# Altium schematic sheet UpDuino Camera Adaptor_V2.0.SchDoc
size B; SheetNumber: 1; SheetTotal: 1
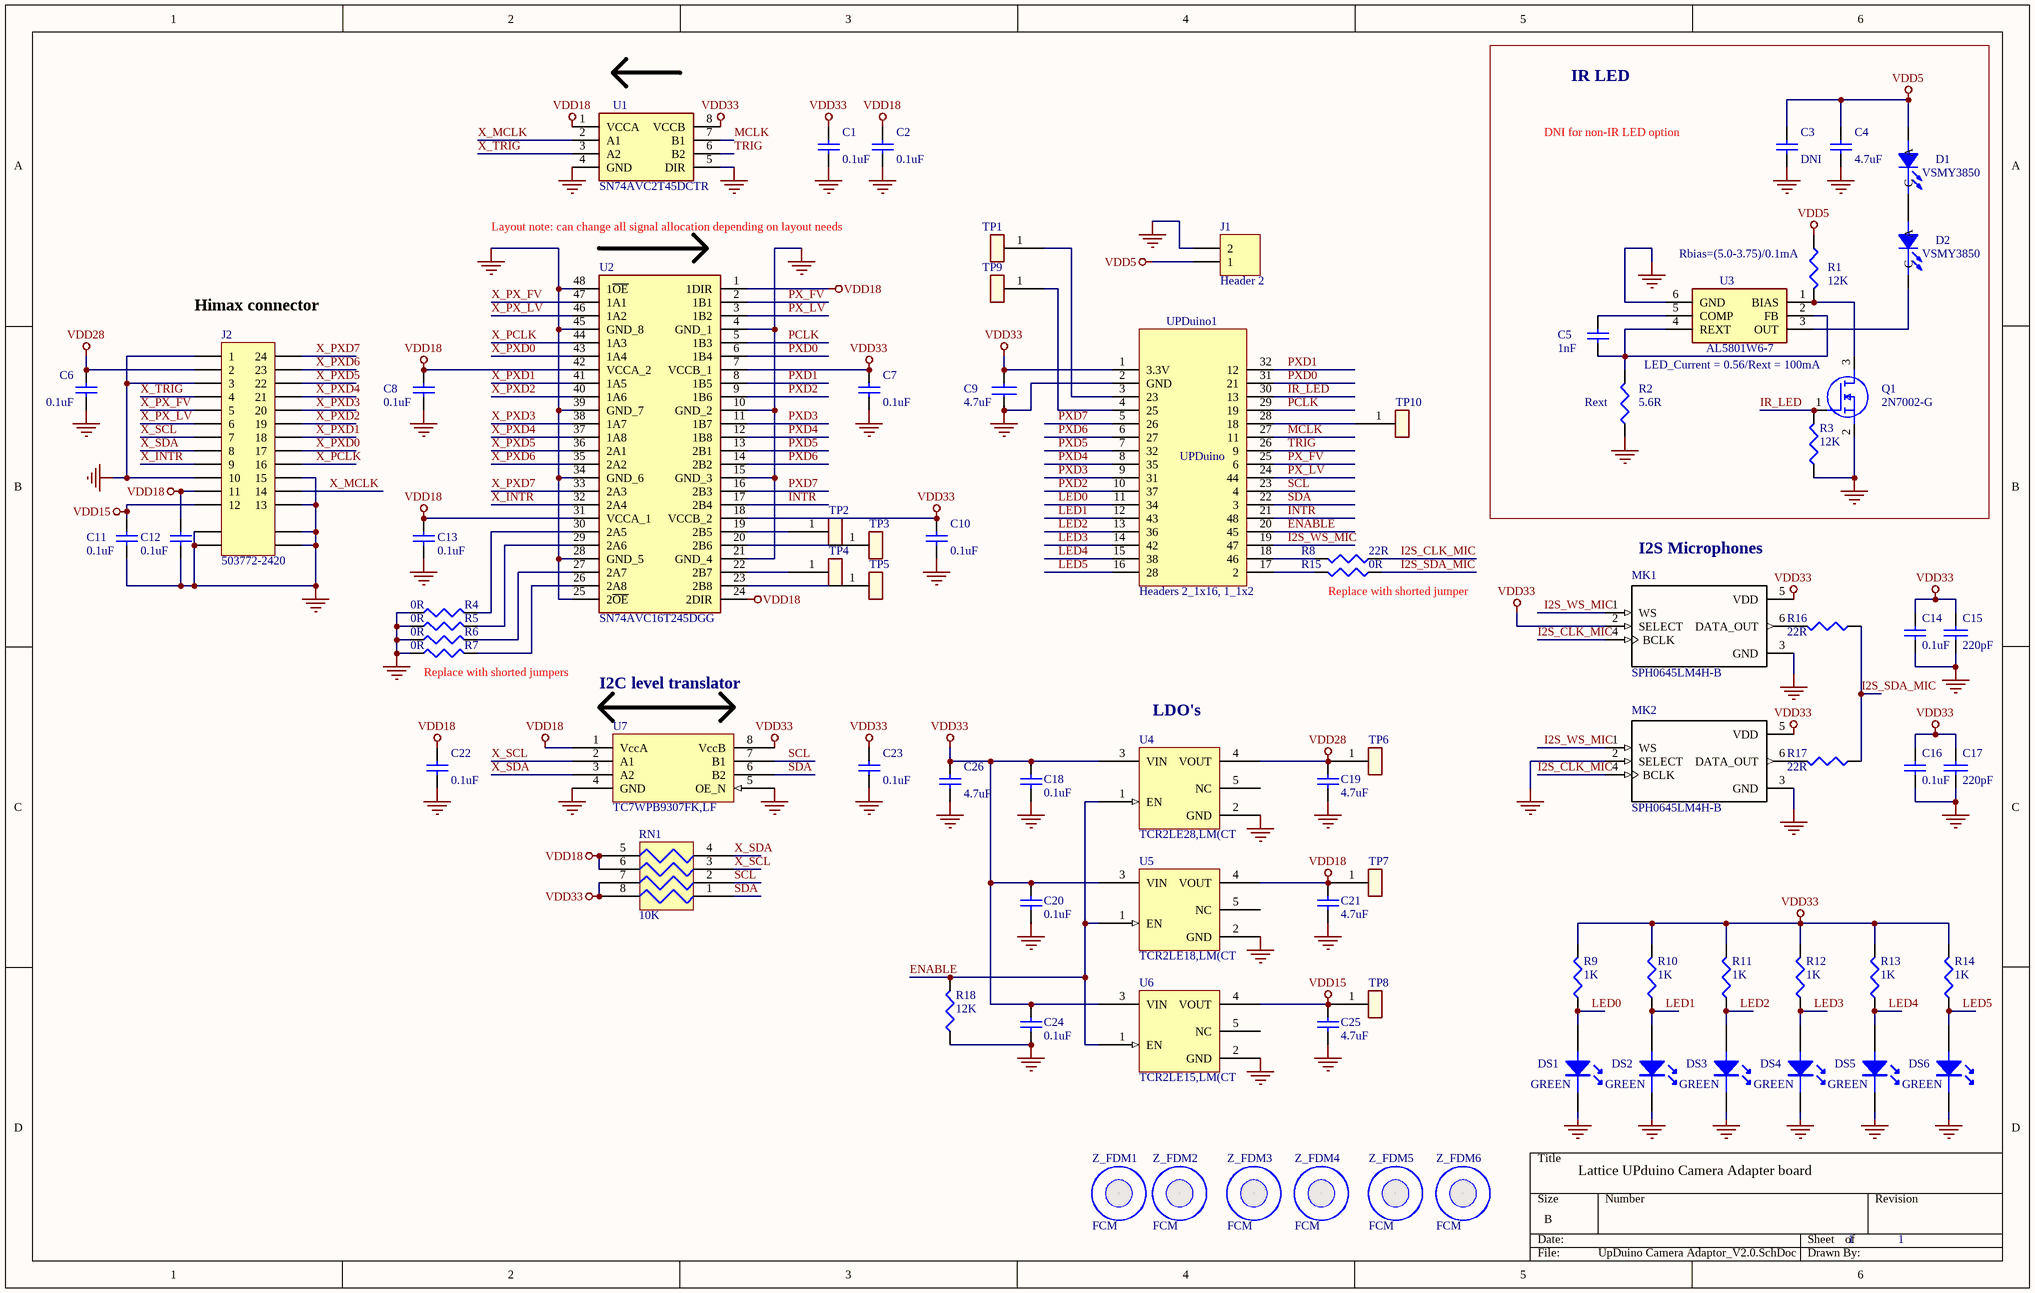
[diagram p0: UpDuino Camera Adaptor_V2.0.SchDoc]

## Parts
C1  0.1uF  [C0603]
C2  0.1uF  [C0603]
C3  DNI  [C0603]
C4  4.7uF  [C0603]
C5  1nF  [C0603]
C6  0.1uF  [C0603]
C7  0.1uF  [C0603]
C8  0.1uF  [C0603]
C9  4.7uF  [C0603]
C10  0.1uF  [C0603]
C11  0.1uF  [C0603]
C12  0.1uF  [C0603]
C13  0.1uF  [C0603]
C14  0.1uF  [C0603]
C15  220pF  [C0603]
C16  0.1uF  [C0603]
C17  220pF  [C0603]
C18  0.1uF  [C0603]
C19  4.7uF  [C0603]
C20  0.1uF  [C0603]
C21  4.7uF  [C0603]
C22  0.1uF  [C0603]
C23  0.1uF  [C0603]
C24  0.1uF  [C0603]
C25  4.7uF  [C0603]
C26  4.7uF  [C0603]
D1  VSMY3850  [PLCC-2]
D2  VSMY3850  [PLCC-2]
DS1  GREEN  [LED_0603_12]
DS2  GREEN  [LED_0603_12]
DS3  GREEN  [LED_0603_12]
DS4  GREEN  [LED_0603_12]
DS5  GREEN  [LED_0603_12]
DS6  GREEN  [LED_0603_12]
J1  Header 2  [HDR1X2]
J2  503772-2420  [MOLEX-5037722410_MOLEX]
MK1  SPH0645LM4H-B  [*MIC_SPH0645LM4H-B]
MK2  SPH0645LM4H-B  [*MIC_SPH0645LM4H-B]
Q1  2N7002-G  [SOT23-3]
R1  12K  [R0603]
R2  5.6R  [R0603]
R3  12K  [R0603]
R4  0R  [SB_0603]
R5  0R  [SB_0603]
R6  0R  [SB_0603]
R7  0R  [SB_0603]
R8  22R  [R0603]
R9  1K  [R0603]
R10  1K  [R0603]
R11  1K  [R0603]
R12  1K  [R0603]
R13  1K  [R0603]
R14  1K  [R0603]
R15  0R  [SB_0603]
R16  22R  [R0603]
R17  22R  [R0603]
R18  12K  [R0603]
RN1  10K  [RN4(0402)]
TP1  TEST POINT  [TP_SMD_D1]  (value not drawn)
TP2  TEST POINT  [TP_SMD_D1]  (value not drawn)
TP3  TEST POINT  [TP_SMD_D1]  (value not drawn)
TP4  TEST POINT  [TP_SMD_D1]  (value not drawn)
TP5  TEST POINT  [TP_SMD_D1]  (value not drawn)
TP6  TEST POINT  [TP_SMD_D1]  (value not drawn)
TP7  TEST POINT  [TP_SMD_D1]  (value not drawn)
TP8  TEST POINT  [TP_SMD_D1]  (value not drawn)
TP9  TEST POINT  [TP_SMD_D1]  (value not drawn)
TP10  TEST POINT  [TP_SMD_D1]  (value not drawn)
U1  SN74AVC2T45DCTR  [MSOP-8(2.95x2.80)]
U2  SN74AVC16T245DGG  [TSSOP-48]
U3  AL5801W6-7  [SOT-23-6-(SSOT-6)]
U4  TCR2LE28,LM(CT  [SOT-553]
U5  TCR2LE18,LM(CT  [SOT-553]
U6  TCR2LE15,LM(CT  [SOT-553]
U7  TC7WPB9307FK,LF  [SSOP8-P-0.50A]
UPDuino1  Headers 2_1x16, 1_1x2  [UPDuino-SMD]
Z_FDM1  FCM  [FID100X250N]
Z_FDM2  FCM  [FID100X250N]
Z_FDM3  FCM  [FID100X250N]
Z_FDM4  FCM  [FID100X250N]
Z_FDM5  FCM  [FID100X250N]
Z_FDM6  FCM  [FID100X250N]

## Blocks framed on the sheet
IR LED: C3-C5 D1 D2 Q1 R1-R3 U3

## Nets
GND: C1.2 C2.2 C3.2 C4.2 C6.2 C7.2 C8.2 C9.1 C10.2 C11.2 C12.2 C13.2 C14.2 C15.2 C16.2 C17.2 C18.1 C19.1 C20.1 C21.1 C22.2 C23.2 C24.1 C25.1 C26.2 DS1.2 DS2.2 DS3.2 DS4.2 DS5.2 DS6.2 J1.2 J2.1 J2.3 J2.10 J2.13 J2.15 J2.GND1 J2.GND2 J2.GND3 J2.GND4 MK1.3(GND) MK2.2(SELECT) MK2.3(GND) Q1.2(S) R2.2 R3.1 R4.2 R5.2 R6.2 R7.2 R18.1 U1.4(GND) U1.5(DIR) U2.4(GND_1) U2.10(GND_2) U2.15(GND_3) U2.21(GND_4) U2.25(2~{OE}) U2.28(GND_5) U2.34(GND_6) U2.39(GND_7) U2.45(GND_8) U2.48(1~{OE}) U3.6(GND) U4.2(GND) U5.2(GND) U6.2(GND) U7.4(GND) U7.5(OE_N) UPDuino1.2(GND)
VDD5: C3.1 C4.1 D1.A J1.1 R1.2
VDD15: C11.1 C25.2 J2.12 TP8.1 U6.4(VOUT)
VDD18: C2.1 C8.1 C12.1 C13.1 C21.2 C22.1 J2.11 RN1.5 RN1.6 TP7.1 U1.1(VCCA) U2.1(1DIR) U2.24(2DIR) U2.31(VCCA_1) U2.42(VCCA_2) U5.4(VOUT) U7.1(VccA)
VDD28: C6.1 C19.2 J2.2 TP6.1 U4.4(VOUT)
VDD33: C1.1 C7.1 C9.2 C10.1 C14.1 C15.1 C16.1 C17.1 C18.2 C20.2 C23.1 C24.2 C26.1 MK1.2(SELECT) MK1.5(VDD) MK2.5(VDD) R9.2 R10.2 R11.2 R12.2 R13.2 R14.2 RN1.7 RN1.8 U1.8(VCCB) U2.7(VCCB_1) U2.18(VCCB_2) U4.3(VIN) U5.3(VIN) U6.3(VIN) U7.8(VccB) UPDuino1.1(3.3V)
ENABLE: R18.2 U4.1(EN) U5.1(EN) U6.1(EN) UPDuino1.20(45)
I2S_CLK_MIC: MK1.4(BCLK) MK2.4(BCLK) R8.1
I2S_SDA_MIC: R15.1 R16.1 R17.1
I2S_WS_MIC: MK1.1(WS) MK2.1(WS) UPDuino1.19(47)
INTR: U2.17(2B4) UPDuino1.21(48)
IR_LED: Q1.1(G) R3.2 UPDuino1.30(13)
LED0: DS1.1 R9.1 UPDuino1.11(34)
LED1: DS2.1 R10.1 UPDuino1.12(43)
LED2: DS3.1 R11.1 UPDuino1.13(36)
LED3: DS4.1 R12.1 UPDuino1.14(42)
LED4: DS5.1 R13.1 UPDuino1.15(38)
LED5: DS6.1 R14.1 UPDuino1.16(28)
MCLK: U1.7(B1) UPDuino1.27(11)
PCLK: U2.5(1B3) UPDuino1.29(19)
PX_FV: U2.2(1B1) UPDuino1.25(6)
PX_LV: U2.3(1B2) UPDuino1.24(44)
PXD0: U2.6(1B4) UPDuino1.31(21)
PXD1: U2.8(1B5) UPDuino1.32(12)
PXD2: U2.9(1B6) UPDuino1.10(37)
PXD3: U2.11(1B7) UPDuino1.9(31)
PXD4: U2.12(1B8) UPDuino1.8(35)
PXD5: U2.13(2B1) UPDuino1.7(32)
PXD6: U2.14(2B2) UPDuino1.6(27)
PXD7: U2.16(2B3) UPDuino1.5(26)
SCL: RN1.2 U7.7(B1) UPDuino1.23(4)
SDA: RN1.1 U7.6(B2) UPDuino1.22(3)
TRIG: U1.6(B2) UPDuino1.26(9)
X_INTR: J2.9 U2.32(2A4)
X_MCLK: J2.14 U1.2(A1)
X_PCLK: J2.16 U2.44(1A3)
X_PX_FV: J2.5 U2.47(1A1)
X_PX_LV: J2.6 U2.46(1A2)
X_PXD0: J2.17 U2.43(1A4)
X_PXD1: J2.18 U2.41(1A5)
X_PXD2: J2.19 U2.40(1A6)
X_PXD3: J2.20 U2.38(1A7)
X_PXD4: J2.21 U2.37(1A8)
X_PXD5: J2.22 U2.36(2A1)
X_PXD6: J2.23 U2.35(2A2)
X_PXD7: J2.24 U2.33(2A3)
X_SCL: J2.7 RN1.3 U7.2(A1)
X_SDA: J2.8 RN1.4 U7.3(A2)
X_TRIG: J2.4 U1.3(A2)
NetC5_1: C5.1 U3.5(COMP)
NetC5_2: C5.2 R2.1 U3.2(FB) U3.4(REXT)
NetD1_C: D1.C D2.A
NetD2_C: D2.C U3.3(OUT)
NetMK1_6: MK1.6(DATA_OUT) R16.2
NetMK2_6: MK2.6(DATA_OUT) R17.2
NetQ1_3: Q1.3(D) R1.1 U3.1(BIAS)
NetR4_1: R4.1 U2.30(2A5)
NetR5_1: R5.1 U2.29(2A6)
NetR6_1: R6.1 U2.27(2A7)
NetR7_1: R7.1 U2.26(2A8)
NetR8_2: R8.2 UPDuino1.18(46)
NetR15_2: R15.2 UPDuino1.17(2)
NetTP1_1: TP1.1 UPDuino1.3(23)
NetTP2_1: TP2.1 U2.19(2B5)
NetTP3_1: TP3.1 U2.20(2B6)
NetTP4_1: TP4.1 U2.22(2B7)
NetTP5_1: TP5.1 U2.23(2B8)
NetTP9_1: TP9.1 UPDuino1.4(25)
NetTP10_1: TP10.1 UPDuino1.28(18)

Not connected (* = marked no-connect by the designer): U4 5(NC); U5 5(NC); U6 5(NC); Z_FDM1 1; Z_FDM2 1; Z_FDM3 1; Z_FDM4 1; Z_FDM5 1; Z_FDM6 1

## Notes on the sheet
- DNI for non-IR LED option
- Layout note: can change all signal allocation depending on layout needs
- (near R1) Rbias=(5.0-3.75)/0.1mA
- (near J2) Himax connector
- (near Q1) LED_Current = 0.56/Rext = 100mA
- (near R2) Rext
- (near MK1) I2S Microphones
- (near R15) Replace with shorted jumper
- (near R7) Replace with shorted jumpers
- I2C level translator
- (near U4) LDO's
- Lattice UPduino Camera Adapter board
- 1
- (in symbol UPDuino_Breakout) UPDuino

## Library data of the parts
C1 C2 C6 C7 C10-C12 C14 C16 C22 C23 = Cap_100nF_X7R_10%_0402: CAP CER 0.1UF 6.3V X5R 0603
C3 = Cap_100nF_X7R_10%_0402
C4 C26 = Cap_100nF_X7R_10%_0402: CAP CER 4.7UF 6.3V X5R 0603
C5 = Cap_100nF_X7R_10%_0402: CAP CER 0.1UF 6.3V X5R 0402; Manufacturer: TDK; Part #: E-CAP-003; ManType: C1005X5R0J104K; Digikey: 445-1266-1-ND; Package: 0402
C8 C13 = Cap_100nF_X7R_10%_0402: CAP CER 0.1UF 6.3V X5R 0402
C9 = CAP NP: 4.7 uF 6.3V X5R
C15 C17 = CAP
C18 C20 C24 = Cap_1uF_X5R_10%_6V3_0402: CAP CER 0.1UF 6.3V X5R 0603
C19 C21 C25 = Cap_1uF_X5R_10%_6V3_0402: CAP CER 4.7UF 6.3V X5R 0603
D1 D2 = LED: EMITTER IR 850NM 70MA 3.20MM SMD; Manufacturer: OSRAM Opto Semiconductors Inc.; Manufacturer Part Number: VSMY12850; ManType: SFH 4253-Z; Viewing Angle: 80°; Forward Current: 20mA; Forward Voltage: 1.4V; Rise Time: 10ns; Touchscreen: Infrared (IR); DigiKey: 475-2868-1-ND; Part #: *; Supplier 1: Avnet; Stock 1: 0; Pricing 1: 1=0.404 (USD); Mount: Surface Mount; Case/Package: 1206; Case Code (Metric): 3216; Case Code (Imperial): 1206; Min Operating Temperature: -40°C; Max Operating Temperature: 85°C; Packaging: Cut Tape; Wavelength: 850nm; Orientation: Top View; REACH SVHC: Unknown; Lead Free: Lead Free
DS1-DS6 = LED_1: Liteon LTST-C191KGKT; Manufacturer: Avago Technologies US Inc.; Part #: E-MISC-005; ManType: HSMG-C170; Digikey: 516-1434-1-ND; Price 100: 0.21200; Package: 0805
J1 = Header 2: Header, 2-Pin; LatestRevisionDate: 17-Jul-2002; LatestRevisionNote: Re-released for DXP Platform.; Publisher: Altium Limited
J2 = Header 12X2A: Header, 12-Pin, Dual row; Manufacturer: Amphenol FCI; Manufacturer Part Number: SFV24R-3STE1HLF; Actuator Material: Glass,Polyphenylene; Voltage Rating: 50V; Current Rating: 500mA; Number of Positions: 24; Contact Location: Bottom; Insulation Resistance: 100MR; Pitch: 0.02inch; LatestRevisionDate: 17-Jul-2002; LatestRevisionNote: Re-released for DXP Platform.; Publisher: Altium Limited; Supplier 1: Mouser; Supplier Part Number 1: 649-SFV24R-3STE1HLF; Stock 1: 6000; Pricing 1: 1=0.41, 10=0.288, 50=0.288, 100=0.276, 1000=0.198, 10000=0.158 (USD); Mount: Surface Mount; Contact Material: Bronze; Contact Plating: Tin; Housing Material: Polymer; Min Operating Temperature: -55°C; Max Operating Temperature: 105°C; Package Quantity: 3000; Packaging: Tape and Reel; Termination: Solder; Flammability Rating: UL94 V-0; ComponentLink1URL: http://portal.fciconnect.com/Comergent//fci/drawing/10117319.pdf?src-supplier=Digi-Key; ComponentLink1Description: http://portal.fciconnect.com/Comergent//fci/drawing/10117319.pdf?src-supplier=Digi-Key
MK1 MK2 = SPH0645LM4H-B: Mic Mems Digital I2s Omni -26db; MFR: Knowles; Package: SIP-7 Bourns; MFR Part No.: SPH0645LM4H-B; Digi-Key_Purchase_URL: https://www.digikey.com/product-detail/en/knowles/SPH0645LM4H-B/423-1405-1-ND/5332432?utm_source=snapeda&utm_medium=aggregator&utm_campaign=symbol; Digi-Key_Part_Number: 423-1405-1-ND; SnapEDA_Link: https://www.snapeda.com/parts/SPH0645LM4H-B/Knowles/view-part/?ref=snap; Value: *
Q1 = 2N7002-G: MOSFET (N-Channel); Manufacturer_Name: Comchip Technology; Datasheet Link: http://www.comchiptech.com/admin/files/product/2N7002-G%20RevB201450.pdf; Height: 1.25mm; Manufacturer_Part_Number: 2N7002-G; Mouser Part Number: 750-2N7002-G; Mouser Price/Stock: https://www.mouser.com/Search/Refine.aspx?Keyword=750-2N7002-G
R1-R18 = R_SH
RN1 = EXB28V: EXB-28V104JX /; Package: 0804
U1 = SN74AVC2T45DCTR: Integrated Circuit; Manufacturer_Name: Texas Instruments; Datasheet Link: http://www.ti.com/lit/ds/symlink/sn74avc2t45.pdf; Height: 1.3mm; Manufacturer_Part_Number: SN74AVC2T45DCTR; Mouser Part Number: 595-SN74AVC2T45DCTR; Mouser Price/Stock: https://www.mouser.com/Search/Refine.aspx?Keyword=595-SN74AVC2T45DCTR; RS Part Number: 8253432P; RS Price/Stock: http://uk.rs-online.com/web/p/products/8253432P
U2 = SN74AVC16T245DGG: Integrated Circuit; Manufacturer_Name: Texas Instruments; Datasheet Link: https://www.ti.com/lit/ds/symlink/sn74avc16t245.pdf; Height: 1.2mm; Manufacturer_Part_Number: SN74AVC16T245DGG; Mouser Part Number: 595-SN74AVC16T245DG; Mouser Price/Stock: https://www.mouser.com/Search/Refine.aspx?Keyword=595-SN74AVC16T245DG
U3 = AL5801W6-7: Integrated Circuit; Manufacturer_Name: Diodes Inc.; Datasheet Link: http://uk.rs-online.com/web/p/products/1222913; Height: 1.3mm; Manufacturer_Part_Number: AL5801W6-7; Mouser Part Number: 621-AL5801W6-7; Mouser Price/Stock: https://www.mouser.com/Search/Refine.aspx?Keyword=621-AL5801W6-7; RS Part Number: 8228732P; RS Price/Stock: http://uk.rs-online.com/web/p/products/8228732P
U4-U6 = TCR2LE12ESV
U7 = TC7WPB9307FK: Dual bidirectional level translator
UPDuino1 = UPDuino_Breakout: UPDuino Breakout Headers; MFR Part No.: HWS15774, HWS15768; MFR: Phoenix contact; LatestRevisionDate: 17-Jul-2002; LatestRevisionNote: Re-released for DXP Platform.